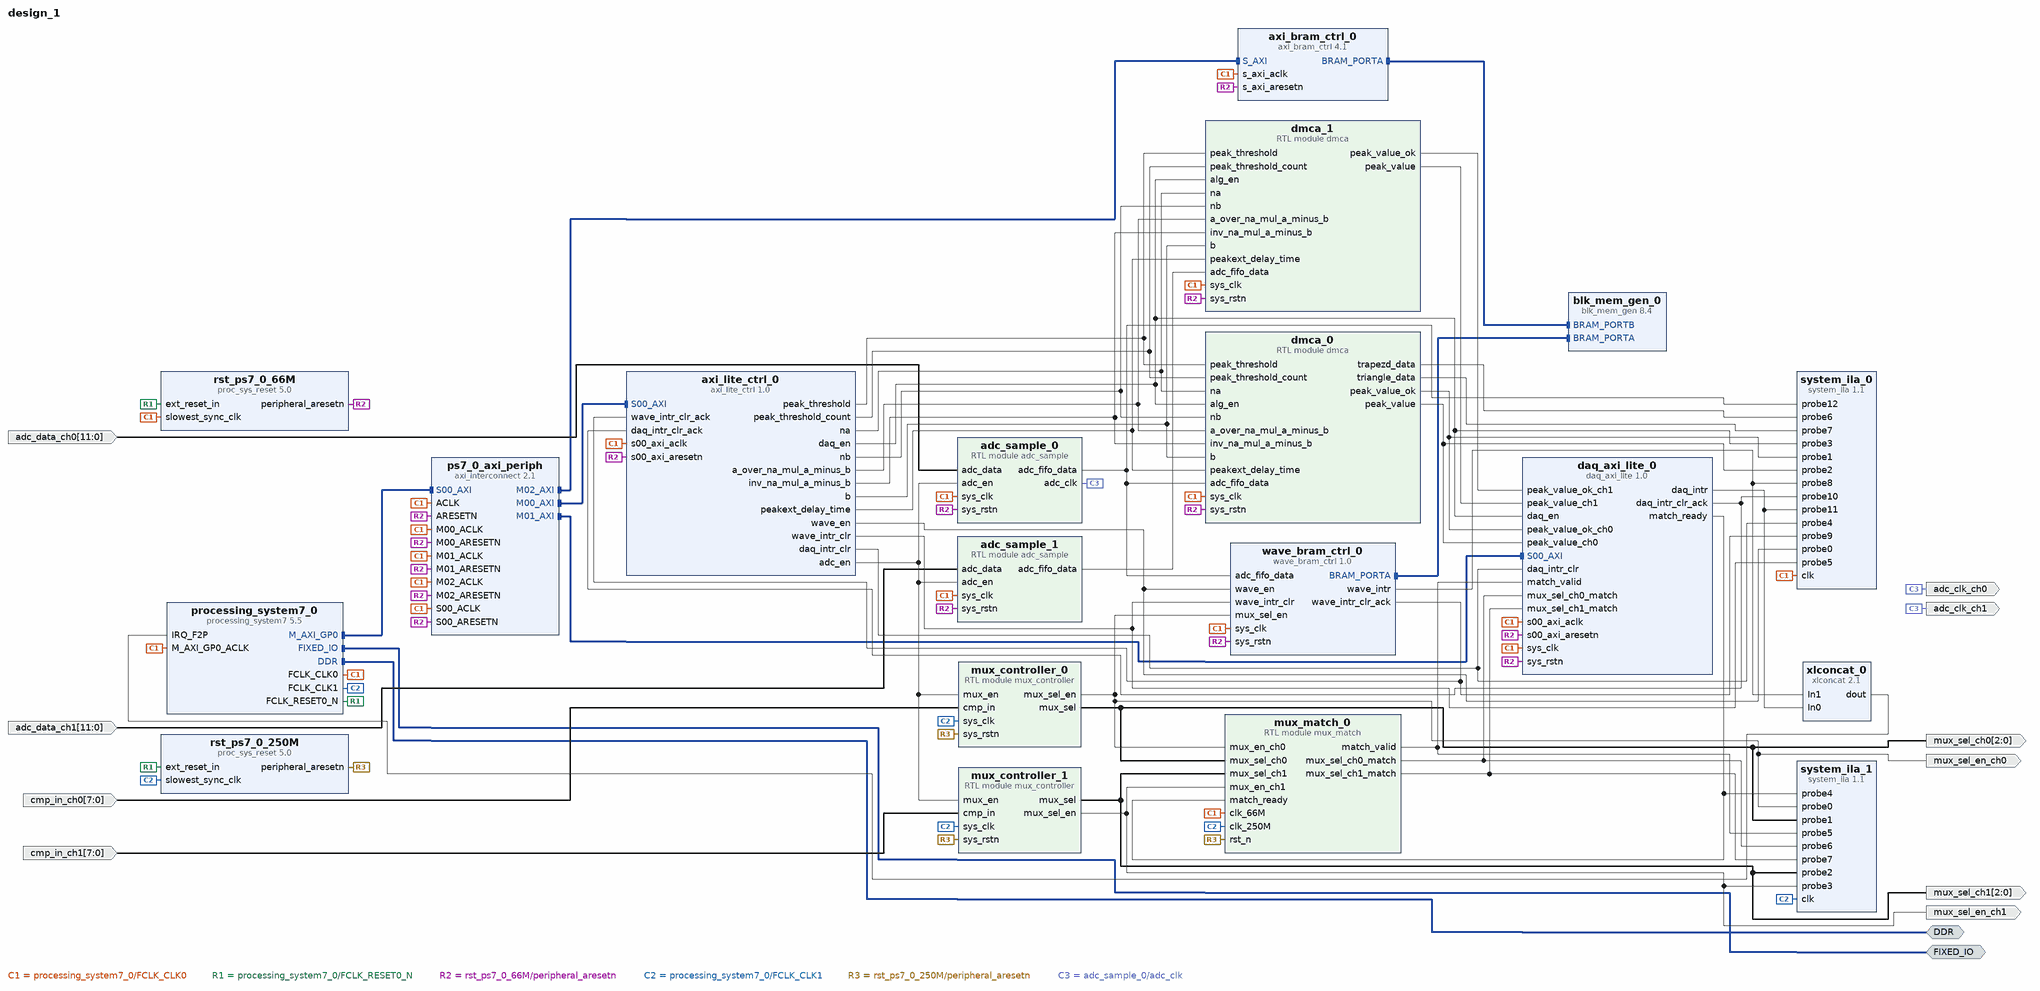
[diagram p0: block diagram of the top level]
# Vivado block design design_1, xc7z020clg400-2, Vivado 2018.3
create_bd_design design_1

create_bd_intf_port -mode Master -vlnv xilinx.com:interface:ddrx_rtl:1.0 DDR
create_bd_intf_port -mode Master -vlnv xilinx.com:display_processing_system7:fixedio_rtl:1.0 FIXED_IO
create_bd_port -dir I -from 11 -to 0 adc_data_ch0
create_bd_port -dir O mux_sel_en_ch0
create_bd_port -dir O -from 2 -to 0 mux_sel_ch0
create_bd_port -dir I -from 7 -to 0 cmp_in_ch0
create_bd_port -dir O -type clk adc_clk_ch0
create_bd_port -dir I -from 11 -to 0 adc_data_ch1
create_bd_port -dir I -from 7 -to 0 cmp_in_ch1
create_bd_port -dir O -type clk adc_clk_ch1
create_bd_port -dir O -from 2 -to 0 mux_sel_ch1
create_bd_port -dir O mux_sel_en_ch1

create_bd_cell -type ip -vlnv xilinx.com:ip:processing_system7:5.5 processing_system7_0
set_property -dict [list \
  CONFIG.PCW_ENET0_ENET0_IO {MIO 16 .. 27} \
  CONFIG.PCW_ENET0_GRP_MDIO_ENABLE 1 \
  CONFIG.PCW_ENET0_GRP_MDIO_IO {MIO 52 .. 53} \
  CONFIG.PCW_ENET0_PERIPHERAL_ENABLE 1 \
  CONFIG.PCW_ENET0_RESET_ENABLE 0 \
  CONFIG.PCW_ENET_RESET_ENABLE 1 \
  CONFIG.PCW_ENET_RESET_SELECT {Share reset pin} \
  CONFIG.PCW_EN_CLK1_PORT 1 \
  CONFIG.PCW_FPGA0_PERIPHERAL_FREQMHZ 65 \
  CONFIG.PCW_FPGA1_PERIPHERAL_FREQMHZ 250 \
  CONFIG.PCW_FPGA2_PERIPHERAL_FREQMHZ 100 \
  CONFIG.PCW_FPGA3_PERIPHERAL_FREQMHZ 100 \
  CONFIG.PCW_FPGA_FCLK1_ENABLE 1 \
  CONFIG.PCW_GPIO_MIO_GPIO_ENABLE 1 \
  CONFIG.PCW_GPIO_MIO_GPIO_IO MIO \
  CONFIG.PCW_I2C0_GRP_INT_ENABLE 0 \
  CONFIG.PCW_I2C0_I2C0_IO {MIO 50 .. 51} \
  CONFIG.PCW_I2C0_PERIPHERAL_ENABLE 1 \
  CONFIG.PCW_I2C_PERIPHERAL_FREQMHZ 111.111115 \
  CONFIG.PCW_I2C_RESET_ENABLE 1 \
  CONFIG.PCW_I2C_RESET_SELECT {Share reset pin} \
  CONFIG.PCW_IRQ_F2P_INTR 1 \
  CONFIG.PCW_PRESET_BANK1_VOLTAGE {LVCMOS 1.8V} \
  CONFIG.PCW_QSPI_GRP_FBCLK_ENABLE 1 \
  CONFIG.PCW_QSPI_GRP_FBCLK_IO {MIO 8} \
  CONFIG.PCW_QSPI_GRP_SINGLE_SS_ENABLE 1 \
  CONFIG.PCW_QSPI_GRP_SINGLE_SS_IO {MIO 1 .. 6} \
  CONFIG.PCW_QSPI_PERIPHERAL_ENABLE 1 \
  CONFIG.PCW_QSPI_QSPI_IO {MIO 1 .. 6} \
  CONFIG.PCW_SD0_GRP_CD_ENABLE 1 \
  CONFIG.PCW_SD0_GRP_CD_IO {MIO 47} \
  CONFIG.PCW_SD0_GRP_WP_ENABLE 0 \
  CONFIG.PCW_SD0_PERIPHERAL_ENABLE 1 \
  CONFIG.PCW_SD0_SD0_IO {MIO 40 .. 45} \
  CONFIG.PCW_SDIO_PERIPHERAL_FREQMHZ 100 \
  CONFIG.PCW_SINGLE_QSPI_DATA_MODE x4 \
  CONFIG.PCW_UART1_BAUD_RATE 460800 \
  CONFIG.PCW_UART1_PERIPHERAL_ENABLE 1 \
  CONFIG.PCW_UART1_UART1_IO {MIO 48 .. 49} \
  CONFIG.PCW_UART_PERIPHERAL_FREQMHZ 100 \
  CONFIG.PCW_UIPARAM_DDR_PARTNO {MT41J256M16 RE-125} \
  CONFIG.PCW_USB0_PERIPHERAL_ENABLE 1 \
  CONFIG.PCW_USB0_RESET_ENABLE 1 \
  CONFIG.PCW_USB0_RESET_IO {MIO 46} \
  CONFIG.PCW_USB0_USB0_IO {MIO 28 .. 39} \
  CONFIG.PCW_USB_RESET_ENABLE 1 \
  CONFIG.PCW_USB_RESET_SELECT {Share reset pin} \
  CONFIG.PCW_USE_FABRIC_INTERRUPT 1 \
] [get_bd_cells processing_system7_0]
# 214 more settings of processing_system7_0 are not shown: defaults, MIO pin electricals, DDR timing, and values the tool derives
create_bd_cell -type ip -vlnv xilinx.com:ip:proc_sys_reset:5.0 rst_ps7_0_66M
create_bd_cell -type ip -vlnv xilinx.com:ip:proc_sys_reset:5.0 rst_ps7_0_250M
create_bd_cell -type ip -vlnv xilinx.com:ip:xlconcat:2.1 xlconcat_0
create_bd_cell -type ip -vlnv xilinx.com:ip:axi_bram_ctrl:4.1 axi_bram_ctrl_0
set_property -dict {CONFIG.SINGLE_PORT_BRAM 1} [get_bd_cells axi_bram_ctrl_0]
create_bd_cell -type ip -vlnv xilinx.com:ip:blk_mem_gen:8.4 blk_mem_gen_0
set_property -dict [list \
  CONFIG.EN_SAFETY_CKT false \
  CONFIG.Enable_B Use_ENB_Pin \
  CONFIG.Memory_Type True_Dual_Port_RAM \
  CONFIG.Port_B_Clock 100 \
  CONFIG.Port_B_Enable_Rate 100 \
  CONFIG.Port_B_Write_Rate 50 \
  CONFIG.Use_RSTB_Pin true \
] [get_bd_cells blk_mem_gen_0]
create_bd_cell -type ip -vlnv xilinx.com:ip:axi_interconnect:2.1 ps7_0_axi_periph
set_property -dict {CONFIG.NUM_MI 3} [get_bd_cells ps7_0_axi_periph]
create_bd_cell -type ip -vlnv xilinx.com:ip:system_ila:1.1 system_ila_0
set_property -dict [list \
  CONFIG.C_DATA_DEPTH 4096 \
  CONFIG.C_MON_TYPE NATIVE \
  CONFIG.C_NUM_OF_PROBES 13 \
  CONFIG.C_PROBE0_TYPE 0 \
  CONFIG.C_PROBE10_TYPE 0 \
  CONFIG.C_PROBE11_TYPE 0 \
  CONFIG.C_PROBE12_TYPE 0 \
  CONFIG.C_PROBE1_TYPE 0 \
  CONFIG.C_PROBE2_TYPE 0 \
  CONFIG.C_PROBE3_TYPE 0 \
  CONFIG.C_PROBE4_TYPE 0 \
  CONFIG.C_PROBE5_TYPE 0 \
  CONFIG.C_PROBE6_TYPE 0 \
  CONFIG.C_PROBE7_TYPE 0 \
  CONFIG.C_PROBE8_TYPE 0 \
  CONFIG.C_PROBE9_TYPE 0 \
] [get_bd_cells system_ila_0]
create_bd_cell -type ip -vlnv xilinx.com:user:wave_bram_ctrl:1.0 wave_bram_ctrl_0
create_bd_cell -type module -reference mux_controller mux_controller_0
create_bd_cell -type module -reference adc_sample adc_sample_0
create_bd_cell -type module -reference adc_sample adc_sample_1
create_bd_cell -type module -reference mux_controller mux_controller_1
create_bd_cell -type ip -vlnv xilinx.com:user:daq_axi_lite:1.0 daq_axi_lite_0
create_bd_cell -type module -reference mux_match mux_match_0
create_bd_cell -type ip -vlnv xilinx.com:ip:system_ila:1.1 system_ila_1
set_property -dict [list \
  CONFIG.C_MON_TYPE NATIVE \
  CONFIG.C_NUM_OF_PROBES 8 \
  CONFIG.C_PROBE0_TYPE 0 \
  CONFIG.C_PROBE1_TYPE 0 \
  CONFIG.C_PROBE2_TYPE 0 \
  CONFIG.C_PROBE3_TYPE 0 \
  CONFIG.C_PROBE4_TYPE 0 \
  CONFIG.C_PROBE5_TYPE 0 \
  CONFIG.C_PROBE6_TYPE 0 \
  CONFIG.C_PROBE7_TYPE 0 \
] [get_bd_cells system_ila_1]
create_bd_cell -type module -reference dmca dmca_0
create_bd_cell -type module -reference dmca dmca_1
create_bd_cell -type ip -vlnv xilinx.com:user:axi_lite_ctrl:1.0 axi_lite_ctrl_0

# ---- connections ----

connect_bd_intf_net [get_bd_intf_pins wave_bram_ctrl_0/BRAM_PORTA] [get_bd_intf_pins blk_mem_gen_0/BRAM_PORTA]
connect_bd_intf_net [get_bd_intf_pins ps7_0_axi_periph/M02_AXI] [get_bd_intf_pins axi_bram_ctrl_0/S_AXI]
connect_bd_intf_net [get_bd_intf_pins processing_system7_0/M_AXI_GP0] [get_bd_intf_pins ps7_0_axi_periph/S00_AXI]
connect_bd_intf_net [get_bd_intf_pins daq_axi_lite_0/S00_AXI] [get_bd_intf_pins ps7_0_axi_periph/M01_AXI]
connect_bd_intf_net [get_bd_intf_pins axi_bram_ctrl_0/BRAM_PORTA] [get_bd_intf_pins blk_mem_gen_0/BRAM_PORTB]
connect_bd_intf_net [get_bd_intf_ports FIXED_IO] [get_bd_intf_pins processing_system7_0/FIXED_IO]
connect_bd_intf_net [get_bd_intf_pins axi_lite_ctrl_0/S00_AXI] [get_bd_intf_pins ps7_0_axi_periph/M00_AXI]
connect_bd_intf_net [get_bd_intf_ports DDR] [get_bd_intf_pins processing_system7_0/DDR]
connect_bd_net [get_bd_pins processing_system7_0/FCLK_CLK0] \
  [get_bd_pins rst_ps7_0_66M/slowest_sync_clk] [get_bd_pins processing_system7_0/M_AXI_GP0_ACLK] \
  [get_bd_pins ps7_0_axi_periph/S00_ACLK] [get_bd_pins ps7_0_axi_periph/M00_ACLK] [get_bd_pins ps7_0_axi_periph/ACLK] \
  [get_bd_pins ps7_0_axi_periph/M01_ACLK] [get_bd_pins axi_bram_ctrl_0/s_axi_aclk] [get_bd_pins ps7_0_axi_periph/M02_ACLK] \
  [get_bd_pins system_ila_0/clk] [get_bd_pins wave_bram_ctrl_0/sys_clk] [get_bd_pins adc_sample_0/sys_clk] \
  [get_bd_pins adc_sample_1/sys_clk] [get_bd_pins daq_axi_lite_0/sys_clk] [get_bd_pins daq_axi_lite_0/s00_axi_aclk] \
  [get_bd_pins mux_match_0/clk_66M] [get_bd_pins dmca_0/sys_clk] [get_bd_pins dmca_1/sys_clk] \
  [get_bd_pins axi_lite_ctrl_0/s00_axi_aclk]
connect_bd_net [get_bd_pins processing_system7_0/FCLK_RESET0_N] [get_bd_pins rst_ps7_0_66M/ext_reset_in] [get_bd_pins rst_ps7_0_250M/ext_reset_in]
connect_bd_net [get_bd_pins rst_ps7_0_66M/peripheral_aresetn] \
  [get_bd_pins ps7_0_axi_periph/S00_ARESETN] [get_bd_pins ps7_0_axi_periph/M00_ARESETN] \
  [get_bd_pins ps7_0_axi_periph/ARESETN] [get_bd_pins ps7_0_axi_periph/M01_ARESETN] \
  [get_bd_pins axi_bram_ctrl_0/s_axi_aresetn] [get_bd_pins ps7_0_axi_periph/M02_ARESETN] \
  [get_bd_pins wave_bram_ctrl_0/sys_rstn] [get_bd_pins adc_sample_0/sys_rstn] [get_bd_pins adc_sample_1/sys_rstn] \
  [get_bd_pins daq_axi_lite_0/sys_rstn] [get_bd_pins daq_axi_lite_0/s00_axi_aresetn] [get_bd_pins dmca_0/sys_rstn] \
  [get_bd_pins dmca_1/sys_rstn] [get_bd_pins axi_lite_ctrl_0/s00_axi_aresetn]
connect_bd_net [get_bd_pins processing_system7_0/FCLK_CLK1] \
  [get_bd_pins rst_ps7_0_250M/slowest_sync_clk] [get_bd_pins mux_controller_0/sys_clk] [get_bd_pins mux_controller_1/sys_clk] \
  [get_bd_pins mux_match_0/clk_250M] [get_bd_pins system_ila_1/clk]
connect_bd_net [get_bd_pins rst_ps7_0_250M/peripheral_aresetn] \
  [get_bd_pins mux_controller_0/sys_rstn] [get_bd_pins mux_controller_1/sys_rstn] [get_bd_pins mux_match_0/rst_n]
connect_bd_net -net adc_data_0_1 [get_bd_ports adc_data_ch0] [get_bd_pins adc_sample_0/adc_data]
connect_bd_net -net mux_controller_0_mux_sel_en [get_bd_pins mux_controller_0/mux_sel_en] \
  [get_bd_ports mux_sel_en_ch0] [get_bd_pins wave_bram_ctrl_0/mux_sel_en] [get_bd_pins mux_match_0/mux_en_ch0] \
  [get_bd_pins system_ila_1/probe0]
connect_bd_net -net mux_controller_0_mux_sel [get_bd_pins mux_controller_0/mux_sel] \
  [get_bd_ports mux_sel_ch0] [get_bd_pins mux_match_0/mux_sel_ch0] [get_bd_pins system_ila_1/probe1]
connect_bd_net -net cmp_in_0_1 [get_bd_ports cmp_in_ch0] [get_bd_pins mux_controller_0/cmp_in]
connect_bd_net -net adc_sample_0_adc_fifo_data [get_bd_pins adc_sample_0/adc_fifo_data] \
  [get_bd_pins system_ila_0/probe12] [get_bd_pins wave_bram_ctrl_0/adc_fifo_data] [get_bd_pins dmca_0/adc_fifo_data]
connect_bd_net [get_bd_pins adc_sample_0/adc_clk] [get_bd_ports adc_clk_ch0] [get_bd_ports adc_clk_ch1]
connect_bd_net [get_bd_pins axi_lite_ctrl_0/adc_en] \
  [get_bd_pins mux_controller_0/mux_en] [get_bd_pins adc_sample_0/adc_en] [get_bd_pins mux_controller_1/mux_en] \
  [get_bd_pins adc_sample_1/adc_en]
connect_bd_net -net axi_lite_ctrl_0_wave_en [get_bd_pins axi_lite_ctrl_0/wave_en] \
  [get_bd_pins system_ila_0/probe0] [get_bd_pins wave_bram_ctrl_0/wave_en]
connect_bd_net -net dmca_0_peak_value_ok [get_bd_pins dmca_0/peak_value_ok] \
  [get_bd_pins system_ila_0/probe1] [get_bd_pins daq_axi_lite_0/peak_value_ok_ch0]
connect_bd_net -net dmca_0_peak_value [get_bd_pins dmca_0/peak_value] [get_bd_pins system_ila_0/probe2] [get_bd_pins daq_axi_lite_0/peak_value_ch0]
connect_bd_net -net axi_lite_ctrl_0_daq_en [get_bd_pins axi_lite_ctrl_0/daq_en] \
  [get_bd_pins system_ila_0/probe3] [get_bd_pins daq_axi_lite_0/daq_en] [get_bd_pins dmca_0/alg_en] \
  [get_bd_pins dmca_1/alg_en]
connect_bd_net -net axi_lite_ctrl_0_daq_intr_clr [get_bd_pins axi_lite_ctrl_0/daq_intr_clr] \
  [get_bd_pins system_ila_0/probe4] [get_bd_pins daq_axi_lite_0/daq_intr_clr]
connect_bd_net -net daq_axi_lite_0_intr_clr_ack [get_bd_pins daq_axi_lite_0/daq_intr_clr_ack] \
  [get_bd_pins system_ila_0/probe10] [get_bd_pins axi_lite_ctrl_0/daq_intr_clr_ack]
connect_bd_net -net axi_lite_ctrl_0_wave_intr_clr [get_bd_pins axi_lite_ctrl_0/wave_intr_clr] \
  [get_bd_pins system_ila_0/probe5] [get_bd_pins wave_bram_ctrl_0/wave_intr_clr]
connect_bd_net -net daq_axi_lite_0_intr [get_bd_pins wave_bram_ctrl_0/wave_intr] [get_bd_pins xlconcat_0/In1] [get_bd_pins system_ila_0/probe8]
connect_bd_net [get_bd_pins xlconcat_0/dout] [get_bd_pins processing_system7_0/IRQ_F2P]
connect_bd_net -net wave_bram_ctrl_0_intr_clr_ack [get_bd_pins wave_bram_ctrl_0/wave_intr_clr_ack] \
  [get_bd_pins system_ila_0/probe9] [get_bd_pins axi_lite_ctrl_0/wave_intr_clr_ack]
connect_bd_net -net wave_bram_ctrl_0_intr [get_bd_pins daq_axi_lite_0/daq_intr] [get_bd_pins xlconcat_0/In0] [get_bd_pins system_ila_0/probe11]
connect_bd_net -net trapezd_data [get_bd_pins dmca_0/trapezd_data] [get_bd_pins system_ila_0/probe6]
connect_bd_net -net triangle_data [get_bd_pins dmca_0/triangle_data] [get_bd_pins system_ila_0/probe7]
connect_bd_net -net adc_data_0_2 [get_bd_ports adc_data_ch1] [get_bd_pins adc_sample_1/adc_data]
connect_bd_net -net cmp_in_0_2 [get_bd_ports cmp_in_ch1] [get_bd_pins mux_controller_1/cmp_in]
connect_bd_net [get_bd_pins adc_sample_1/adc_fifo_data] [get_bd_pins dmca_1/adc_fifo_data]
connect_bd_net -net mux_controller_1_mux_sel [get_bd_pins mux_controller_1/mux_sel] \
  [get_bd_ports mux_sel_ch1] [get_bd_pins mux_match_0/mux_sel_ch1] [get_bd_pins system_ila_1/probe2]
connect_bd_net -net mux_controller_1_mux_sel_en [get_bd_pins mux_controller_1/mux_sel_en] \
  [get_bd_ports mux_sel_en_ch1] [get_bd_pins mux_match_0/mux_en_ch1] [get_bd_pins system_ila_1/probe3]
connect_bd_net -net daq_axi_lite_0_match_ready [get_bd_pins daq_axi_lite_0/match_ready] \
  [get_bd_pins mux_match_0/match_ready] [get_bd_pins system_ila_1/probe4]
connect_bd_net -net mux_match_0_match_valid [get_bd_pins mux_match_0/match_valid] \
  [get_bd_pins daq_axi_lite_0/match_valid] [get_bd_pins system_ila_1/probe5]
connect_bd_net [get_bd_pins dmca_1/peak_value_ok] [get_bd_pins daq_axi_lite_0/peak_value_ok_ch1]
connect_bd_net [get_bd_pins dmca_1/peak_value] [get_bd_pins daq_axi_lite_0/peak_value_ch1]
connect_bd_net -net mux_match_0_mux_sel_ch0_out [get_bd_pins mux_match_0/mux_sel_ch0_match] \
  [get_bd_pins daq_axi_lite_0/mux_sel_ch0_match] [get_bd_pins system_ila_1/probe6]
connect_bd_net -net mux_match_0_mux_sel_ch1_out [get_bd_pins mux_match_0/mux_sel_ch1_match] \
  [get_bd_pins daq_axi_lite_0/mux_sel_ch1_match] [get_bd_pins system_ila_1/probe7]
connect_bd_net [get_bd_pins axi_lite_ctrl_0/peak_threshold] [get_bd_pins dmca_0/peak_threshold] [get_bd_pins dmca_1/peak_threshold]
connect_bd_net [get_bd_pins axi_lite_ctrl_0/peak_threshold_count] [get_bd_pins dmca_0/peak_threshold_count] [get_bd_pins dmca_1/peak_threshold_count]
connect_bd_net [get_bd_pins axi_lite_ctrl_0/na] [get_bd_pins dmca_0/na] [get_bd_pins dmca_1/na]
connect_bd_net [get_bd_pins axi_lite_ctrl_0/nb] [get_bd_pins dmca_0/nb] [get_bd_pins dmca_1/nb]
connect_bd_net [get_bd_pins axi_lite_ctrl_0/a_over_na_mul_a_minus_b] \
  [get_bd_pins dmca_0/a_over_na_mul_a_minus_b] [get_bd_pins dmca_1/a_over_na_mul_a_minus_b]
connect_bd_net [get_bd_pins axi_lite_ctrl_0/inv_na_mul_a_minus_b] [get_bd_pins dmca_0/inv_na_mul_a_minus_b] [get_bd_pins dmca_1/inv_na_mul_a_minus_b]
connect_bd_net [get_bd_pins axi_lite_ctrl_0/b] [get_bd_pins dmca_0/b] [get_bd_pins dmca_1/b]
connect_bd_net [get_bd_pins axi_lite_ctrl_0/peakext_delay_time] [get_bd_pins dmca_0/peakext_delay_time] [get_bd_pins dmca_1/peakext_delay_time]
set_property HDL_ATTRIBUTE.BMM_INFO_PROCESSOR {arm > design_1 axi_bram_ctrl_0} [get_bd_cells processing_system7_0]
set_property HDL_ATTRIBUTE.KEEP_HIERARCHY yes [get_bd_cells processing_system7_0]
set_property HDL_ATTRIBUTE.BMM_INFO_ADDRESS_SPACE {byte  0x40000000 32 > design_1 blk_mem_gen_0} [get_bd_cells axi_bram_ctrl_0]
set_property HDL_ATTRIBUTE.KEEP_HIERARCHY yes [get_bd_cells axi_bram_ctrl_0]
set_property HDL_ATTRIBUTE.DEBUG true [get_bd_nets mux_controller_0_mux_sel_en]
set_property HDL_ATTRIBUTE.MARK_DEBUG true [get_bd_nets mux_controller_0_mux_sel_en]
set_property HDL_ATTRIBUTE.DEBUG true [get_bd_nets mux_controller_0_mux_sel]
set_property HDL_ATTRIBUTE.MARK_DEBUG true [get_bd_nets mux_controller_0_mux_sel]
set_property HDL_ATTRIBUTE.DEBUG true [get_bd_nets adc_sample_0_adc_fifo_data]
set_property HDL_ATTRIBUTE.MARK_DEBUG true [get_bd_nets adc_sample_0_adc_fifo_data]
set_property HDL_ATTRIBUTE.DEBUG true [get_bd_nets axi_lite_ctrl_0_wave_en]
set_property HDL_ATTRIBUTE.MARK_DEBUG true [get_bd_nets axi_lite_ctrl_0_wave_en]
set_property HDL_ATTRIBUTE.DEBUG true [get_bd_nets dmca_0_peak_value_ok]
set_property HDL_ATTRIBUTE.MARK_DEBUG true [get_bd_nets dmca_0_peak_value_ok]
set_property HDL_ATTRIBUTE.DEBUG true [get_bd_nets dmca_0_peak_value]
set_property HDL_ATTRIBUTE.MARK_DEBUG true [get_bd_nets dmca_0_peak_value]
set_property HDL_ATTRIBUTE.DEBUG true [get_bd_nets axi_lite_ctrl_0_daq_en]
set_property HDL_ATTRIBUTE.MARK_DEBUG true [get_bd_nets axi_lite_ctrl_0_daq_en]
set_property HDL_ATTRIBUTE.DEBUG true [get_bd_nets axi_lite_ctrl_0_daq_intr_clr]
set_property HDL_ATTRIBUTE.MARK_DEBUG true [get_bd_nets axi_lite_ctrl_0_daq_intr_clr]
set_property HDL_ATTRIBUTE.DEBUG true [get_bd_nets daq_axi_lite_0_intr_clr_ack]
set_property HDL_ATTRIBUTE.MARK_DEBUG true [get_bd_nets daq_axi_lite_0_intr_clr_ack]
set_property HDL_ATTRIBUTE.DEBUG true [get_bd_nets axi_lite_ctrl_0_wave_intr_clr]
set_property HDL_ATTRIBUTE.MARK_DEBUG true [get_bd_nets axi_lite_ctrl_0_wave_intr_clr]
set_property HDL_ATTRIBUTE.DEBUG true [get_bd_nets daq_axi_lite_0_intr]
set_property HDL_ATTRIBUTE.MARK_DEBUG true [get_bd_nets daq_axi_lite_0_intr]
set_property HDL_ATTRIBUTE.DEBUG true [get_bd_nets wave_bram_ctrl_0_intr_clr_ack]
set_property HDL_ATTRIBUTE.MARK_DEBUG true [get_bd_nets wave_bram_ctrl_0_intr_clr_ack]
set_property HDL_ATTRIBUTE.DEBUG true [get_bd_nets wave_bram_ctrl_0_intr]
set_property HDL_ATTRIBUTE.MARK_DEBUG true [get_bd_nets wave_bram_ctrl_0_intr]
set_property HDL_ATTRIBUTE.DEBUG true [get_bd_nets trapezd_data]
set_property HDL_ATTRIBUTE.MARK_DEBUG true [get_bd_nets trapezd_data]
set_property HDL_ATTRIBUTE.DEBUG true [get_bd_nets triangle_data]
set_property HDL_ATTRIBUTE.MARK_DEBUG true [get_bd_nets triangle_data]
set_property HDL_ATTRIBUTE.DEBUG true [get_bd_nets mux_controller_1_mux_sel]
set_property HDL_ATTRIBUTE.MARK_DEBUG true [get_bd_nets mux_controller_1_mux_sel]
set_property HDL_ATTRIBUTE.DEBUG true [get_bd_nets mux_controller_1_mux_sel_en]
set_property HDL_ATTRIBUTE.MARK_DEBUG true [get_bd_nets mux_controller_1_mux_sel_en]
set_property HDL_ATTRIBUTE.DEBUG true [get_bd_nets daq_axi_lite_0_match_ready]
set_property HDL_ATTRIBUTE.MARK_DEBUG true [get_bd_nets daq_axi_lite_0_match_ready]
set_property HDL_ATTRIBUTE.DEBUG true [get_bd_nets mux_match_0_match_valid]
set_property HDL_ATTRIBUTE.MARK_DEBUG true [get_bd_nets mux_match_0_match_valid]
set_property HDL_ATTRIBUTE.DEBUG true [get_bd_nets mux_match_0_mux_sel_ch0_out]
set_property HDL_ATTRIBUTE.MARK_DEBUG true [get_bd_nets mux_match_0_mux_sel_ch0_out]
set_property HDL_ATTRIBUTE.DEBUG true [get_bd_nets mux_match_0_mux_sel_ch1_out]
set_property HDL_ATTRIBUTE.MARK_DEBUG true [get_bd_nets mux_match_0_mux_sel_ch1_out]

# ---- address map ----
assign_bd_address -offset 0x40000000 -range 8K -target_address_space [get_bd_addr_spaces processing_system7_0/Data] [get_bd_addr_segs axi_bram_ctrl_0/S_AXI/Mem0]
assign_bd_address -offset 0x43C00000 -range 64K -target_address_space [get_bd_addr_spaces processing_system7_0/Data] [get_bd_addr_segs axi_lite_ctrl_0/S00_AXI/S00_AXI_reg]
assign_bd_address -offset 0x43C10000 -range 64K -target_address_space [get_bd_addr_spaces processing_system7_0/Data] [get_bd_addr_segs daq_axi_lite_0/S00_AXI/S00_AXI_reg]

validate_bd_design
save_bd_design
